# EAGLE design board (EAGLE 9.3.1)
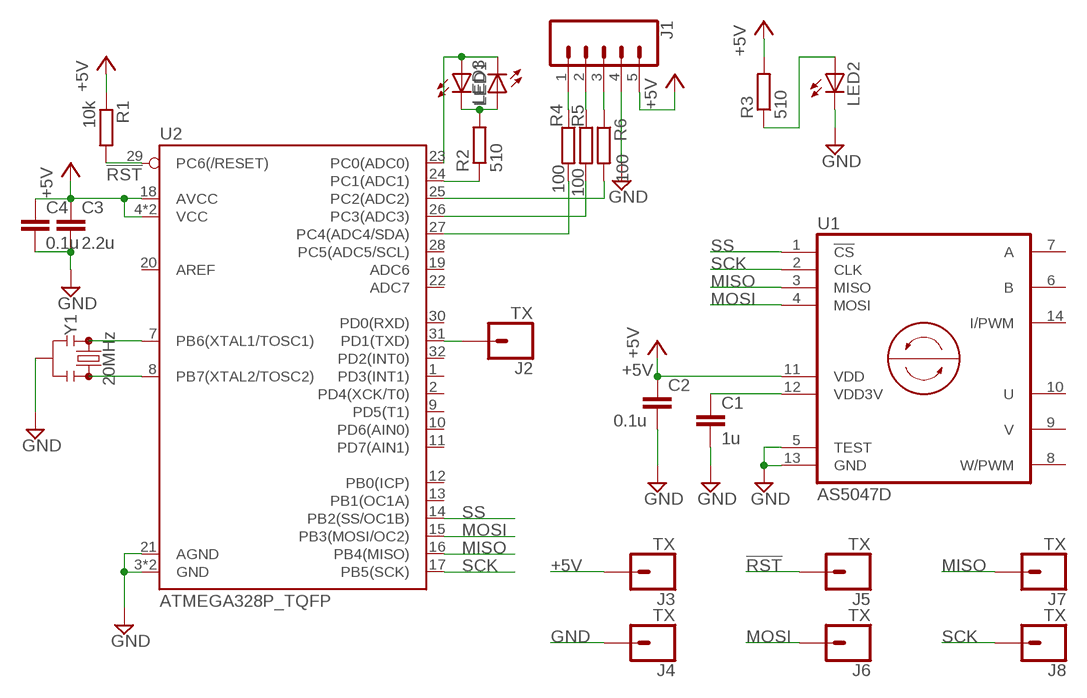
[diagram p0: schematic, sheet 1]

## Parts
C1  1u  C-EUC0603  [C0603]
C2  0.1u  C-EUC0603  [C0603]
C3  2.2u  C-EUC0603  [C0603]
C4  0.1u  C-EUC0603  [C0603]
J1  CONN_05PTH_LONGPADS  [1X05_LONGPADS]
J2  TX  CONN_01PTH_NO_SILK_YES_STOP  [1X01_NO_SILK]
J3  TX  CONN_01PTH_NO_SILK_YES_STOP  [1X01_NO_SILK]
J4  TX  CONN_01PTH_NO_SILK_YES_STOP  [1X01_NO_SILK]
J5  TX  CONN_01PTH_NO_SILK_YES_STOP  [1X01_NO_SILK]
J6  TX  CONN_01PTH_NO_SILK_YES_STOP  [1X01_NO_SILK]
J7  TX  CONN_01PTH_NO_SILK_YES_STOP  [1X01_NO_SILK]
J8  TX  CONN_01PTH_NO_SILK_YES_STOP  [1X01_NO_SILK]
LED1  LEDSML0805  [SML0805]
LED2  LEDSML0805  [SML0805]
LED3  LEDSML0805  [SML0805]
R1  10k  R-EU_R0603  [R0603]
R2  510  R-EU_R0603  [R0603]
R3  510  R-EU_R0603  [R0603]
R4  100  R-EU_R0603  [R0603]
R5  100  R-EU_R0603  [R0603]
R6  100  R-EU_R0603  [R0603]
U1  AS5047D  AS5047P  [TSSOP14]
U2  ATMEGA328P_TQFP  [TQFP32-08]
Y1  20MHz  CSTCE20M0V53-R0SMD_3.2X1.3  [CSTCE20M0V53-R0]

## Nets
!RST: J5.1 R1.2 U2.29(PC6(/RESET))
+5V: C2.1 C3.1 C4.1 J1.5 J3.1 R1.1 R3.2 U1.11(VDD) U2.4(VCC) U2.6(VCC) U2.18(AVCC)
GND: C1.2 C2.2 C3.2 C4.2 J1.4 J4.1 LED2.C U1.5(TEST) U1.13(GND) U2.3(GND) U2.5(GND) U2.21(AGND) Y1.2
MISO: J7.1 U1.3(MISO) U2.16(PB4(MISO))
MOSI: J6.1 U1.4(MOSI) U2.15(PB3(MOSI/OC2))
N$1: U2.7(PB6(XTAL1/TOSC1)) Y1.1
N$2: U2.8(PB7(XTAL2/TOSC2)) Y1.3
N$3: R6.2 U2.25(PC2(ADC2))
N$4: R4.2 U2.27(PC4(ADC4/SDA))
N$5: R5.2 U2.26(PC3(ADC3))
N$7: LED1.A LED3.C U2.23(PC0(ADC0))
N$8: J1.1 R4.1
N$9: LED2.A R3.1
N$10: J2.1 U2.31(PD1(TXD))
N$11: J1.2 R5.1
N$13: R2.1 U2.24(PC1(ADC1))
N$14: LED1.C LED3.A R2.2
N$15: J1.3 R6.1
SCK: J8.1 U1.2(CLK) U2.17(PB5(SCK))
SS: U1.1(!CS!) U2.14(PB2(SS/OC1B))
VDD3V: C1.1 U1.12(VDD3V)
Unconnected: U1.6(B) U1.7(A) U1.8(W/PWM) U1.9(V) U1.10(U) U1.14(I/PWM) U2.1(PD3(INT1)) U2.2(PD4(XCK/T0)) U2.9(PD5(T1)) U2.10(PD6(AIN0)) U2.11(PD7(AIN1)) U2.12(PB0(ICP)) U2.13(PB1(OC1A)) U2.19(ADC6) U2.20(AREF) U2.22(ADC7) U2.28(PC5(ADC5/SCL)) U2.30(PD0(RXD)) U2.32(PD2(INT0))

## Library data of the parts
C1-C4 = rcl:C-EU: CAPACITOR, European symbol; SPICEPREFIX: C
J1 = SparkFun-Connectors:CONN_05: Multi connection point. Often used as Generic Header-pin footprint for 0.1 inch spaced/style header connections On any of the 0.1 inch spaced packages, you can populate with these: Break Away Headers - Straight <https://www.sparkfun.com/products/116> (PRT-00116) Break Away Male Headers - Right Angle <https://www.sparkfun.com/products/553> (PRT-00553) Female Headers <https://www.sparkfun.com/products/115> (PRT-00115) Break Away Headers - Machine Pin <https://www.sparkfun.com/products/117> (PRT-00117) Break Away Female Headers - Swiss Machine Pin <https://www.sparkfun.com/products/743> (PRT-00743) For SCREWTERMINALS and SPRING TERMINALS visit here: Screw Terimnals on SparkFun.com <https://www.sparkfun.com/search/results?term=Screw+Terminals> (5mm/3.5mm/2.54mm spacing) This device is also useful as a general connection point to wire up your design to another part of your project. Our various solder wires solder well into these plated through hole pads. Hook-Up Wire - Assortment (Stranded, 22 AWG) <https://www.sparkfun.com/products/11375> (PRT-11375) Hook-Up Wire - Assortment (Solid Core, 22 AWG) <https://www.sparkfun.com/products/11367> (PRT-11367) View the entire wire category on our website here <https://www.sparkfun.com/categories/141> Special notes: Molex polarized connector foot print use with SKU : PRT-08231 with associated crimp pins and housings. 1MM SMD Version SKU: PRT-10208
J2-J8 = SparkFun-Connectors:CONN_01: Single connection point. Often used as Generic Header-pin footprint for 0.1 inch spaced/style header connections On any of the 0.1 inch spaced packages, you can populate with these: Break Away Headers - Straight <https://www.sparkfun.com/products/116> (PRT-00116) Break Away Male Headers - Right Angle <https://www.sparkfun.com/products/553> (PRT-00553) Female Headers <https://www.sparkfun.com/products/115> (PRT-00115) Break Away Headers - Machine Pin <https://www.sparkfun.com/products/117> (PRT-00117) Break Away Female Headers - Swiss Machine Pin <https://www.sparkfun.com/products/743> (PRT-00743) This device is also useful as a general connection point to wire up your design to another part of your project. Our various solder wires solder well into these plated through hole pads. Hook-Up Wire - Assortment (Stranded, 22 AWG) <https://www.sparkfun.com/products/11375> (PRT-11375) Hook-Up Wire - Assortment (Solid Core, 22 AWG) <https://www.sparkfun.com/products/11367> (PRT-11367) View the entire wire category on our website here <https://www.sparkfun.com/categories/141> Special notes: SMTSO-256-ET is a "flush mount" nut for a 4-40 screw. We mostly use this on specialty testbeds; it is a nice way to connect hardware to your PCB at an adjustable hieght. Also note, the SNAP packages are for using a snappable style connector. We sell a baggie of snaps and they are also used on two LilyPad designs: Snap Assortment - 30 pack (male and female) <https://www.sparkfun.com/products/11347> (DEV-11347) LilyPad Arduino SimpleSnap <https://www.sparkfun.com/products/10941> (DEV-10941) LilyPad SimpleSnap Protoboard <https://www.sparkfun.com/products/10940> (DEV-10940)
LED1-LED3 = led:LED: LED OSRAM: - CHIPLED LG R971, LG N971, LY N971, LG Q971, LY Q971, LO R971, LY R971 LH N974, LH R974 LS Q976, LO Q976, LY Q976 LO Q996 - Hyper CHIPLED LW Q18S LB Q993, LB Q99A, LB R99A - SideLED LS A670, LO A670, LY A670, LG A670, LP A670 LB A673, LV A673, LT A673, LW A673 LH A674 LY A675 LS A676, LA A676, LO A676, LY A676, LW A676 LS A679, LY A679, LG A679 - Hyper Micro SIDELED® LS Y876, LA Y876, LO Y876, LY Y876 LT Y87S - SmartLED LW L88C, LW L88S LB L89C, LB L89S, LG L890 LS L89K, LO L89K, LY L89K LS L896, LA L896, LO L896, LY L896 - TOPLED LS T670, LO T670, LY T670, LG T670, LP T670 LSG T670, LSP T670, LSY T670, LOP T670, LYG T670 LG T671, LOG T671, LSG T671 LB T673, LV T673, LT T673, LW T673 LH T674 LS T676, LA T676, LO T676, LY T676, LB T676, LH T676, LSB T676, LW T676 LB T67C, LV T67C, LT T67C, LS T67K, LO T67K, LY T67K, LW E67C LS E67B, LA E67B, LO E67B, LY E67B, LB E67C, LV E67C, LT E67C LW T67C LS T679, LY T679, LG T679 LS T770, LO T770, LY T770, LG T770, LP T770 LB T773, LV T773, LT T773, LW T773 LH T774 LS E675, LA E675, LY E675, LS T675 LS T776, LA T776, LO T776, LY T776, LB T776 LHGB T686 LT T68C, LB T68C - Hyper Mini TOPLED® LB M676 - Mini TOPLED Santana® LG M470 LS M47K, LO M47K, LY M47K Source: http://www.osram.convergy.de LUXEON: - LUMILED® LXK2-PW12-R00, LXK2-PW12-S00, LXK2-PW14-U00, LXK2-PW14-V00 LXK2-PM12-R00, LXK2-PM12-S00, LXK2-PM14-U00 LXK2-PE12-Q00, LXK2-PE12-R00, LXK2-PE12-S00, LXK2-PE14-T00, LXK2-PE14-U00 LXK2-PB12-K00, LXK2-PB12-L00, LXK2-PB12-M00, LXK2-PB14-N00, LXK2-PB14-P00, LXK2-PB14-Q00 LXK2-PR12-L00, LXK2-PR12-M00, LXK2-PR14-Q00, LXK2-PR14-R00 LXK2-PD12-Q00, LXK2-PD12-R00, LXK2-PD12-S00 LXK2-PH12-R00, LXK2-PH12-S00 LXK2-PL12-P00, LXK2-PL12-Q00, LXK2-PL12-R00 Source: www.luxeon.com KINGBRIGHT: KA-3528ASYC Source: www.kingbright.com
R1-R6 = rcl:R-EU_: RESISTOR, European symbol; SPICEPREFIX: R
U1 = ams:AS5047: ROTARY ENCODER 14-bit On-Axis Magnetic Rotary Position Sensor 12-Bit Decimal & Binary Incremental Pulse Count 28krpm high speed capability
U2 = SparkFun-IC-Microcontroller:ATMEGA328P_TQFP: Popular 328P in QFP Storefront component: ATmega328 - TQFP <https://www.sparkfun.com/products/13448> (COM-13448) Datasheet <http://www.sparkfun.com/datasheets/Components/SMD/ATMega328.pdf> SparkFun Products SparkFun RedBoard - Programmed with Arduino <https://www.sparkfun.com/products/12757> (DEV-12757) Arduino Pro Mini 328 - 5V/16MHz <https://www.sparkfun.com/products/11113> (DEV-11113) Arduino Pro Mini 328 - 3.3V/8MHz <https://www.sparkfun.com/products/11114> (DEV-11114) SparkFun OpenLog <https://www.sparkfun.com/products/13712> (DEV-13712) SparkFun MicroView - OLED Arduino Module <https://www.sparkfun.com/products/12923> (DEV-12923) SparkFun Digital Sandbox <https://www.sparkfun.com/products/12651> (DEV-12651) SparkFun PicoBoard <https://www.sparkfun.com/products/11888> (WIG-11888) Arduino Fio <https://www.sparkfun.com/products/10116> (DEV-10116) LilyPad Arduino 328 Main Board <https://www.sparkfun.com/products/13342> (DEV-13342) SparkFun RedStick <https://www.sparkfun.com/products/13741> (DEV-13741) LilyPad MP3 <https://www.sparkfun.com/products/11013> (DEV-11013) LilyPad Arduino SimpleSnap <https://www.sparkfun.com/products/10941> (DEV-10941) SparkFun Stepoko <https://www.sparkfun.com/products/13899> (ROB-13899) SparkFun Geiger Counter <https://www.sparkfun.com/products/11345> (SEN-11345) SparkFun EL Sequencer <https://www.sparkfun.com/products/12781> (COM-12781) Arduino Pro 328 - 5V/16MHz <https://www.sparkfun.com/products/10915> (DEV-10915) CryptoCape <https://www.sparkfun.com/products/12773> (DEV-12773) SparkFun IR Thermometer Evaluation Board - MLX90614 <https://www.sparkfun.com/products/10740> (SEN-10740) SparkFun RedBot Mainboard <https://www.sparkfun.com/products/12097> (ROB-12097) Arduino Pro 328 - 3.3V/8MHz <https://www.sparkfun.com/products/10914> (DEV-10914) SparkFun Block for Intel® Edison - Arduino <https://www.sparkfun.com/products/13036> (DEV-13036) SparkFun Simon Says - Surface Mount Soldering Kit <https://www.sparkfun.com/products/10935> (KIT-10935) SparkFun 7-Segment Serial Display - Red <https://www.sparkfun.com/products/11441> (COM-11441) SparkFun 7-Segment Serial Display - White <https://www.sparkfun.com/products/11629> (COM-11629) SparkFun 7-Segment Serial Display - Yellow <https://www.sparkfun.com/products/11443> (COM-11443) SparkFun 7-Segment Serial Display - Kelly Green <https://www.sparkfun.com/products/11440> (COM-11440) SparkFun 7-Segment Serial Display - Blue <https://www.sparkfun.com/products/11442> (COM-11442) SparkFun OpenSegment Serial Display - 20mm (Blue) <https://www.sparkfun.com/products/11647> (COM-11647) SparkFun OpenSegment Serial Display - 20mm (Green) <https://www.sparkfun.com/products/11646> (COM-11646) SparkFun OpenSegment Serial Display - 20mm (White) <https://www.sparkfun.com/products/11648> (COM-11648) SparkFun OpenSegment Serial Display - 20mm (Red) <https://www.sparkfun.com/products/11644> (COM-11644) SparkFun OpenSegment Serial Display - 20mm (Yellow) <https://www.sparkfun.com/products/11645> (COM-11645) SparkFun OpenSegment Shield <https://www.sparkfun.com/products/13190> (DEV-13190); PROD_ID: IC-09069
Y1 = AS5047D:CSTCE20M0V53-R0: 20MHz Resonator Digikey Example <http://www.digikey.com/product-detail/en/murata-electronics-north-america/CSTCE16M0V53-R0/490-1198-1-ND/584635> Frequency: 20MHz Frequency Stability: ±0.3% Frequency Tolerance: ±0.5% Capacitance: 15pF SparkFun Products SparkFun OpenLog <https://www.sparkfun.com/products/13712> SparkFun MicroView - OLED Arduino Module <https://www.sparkfun.com/products/12923>; PROD_ID: XTAL-08900; VALUE: 16MHz

## Net classes
0 default: width 0.008 mm, drill 0.013 mm, clearance 0.008 mm

## Board
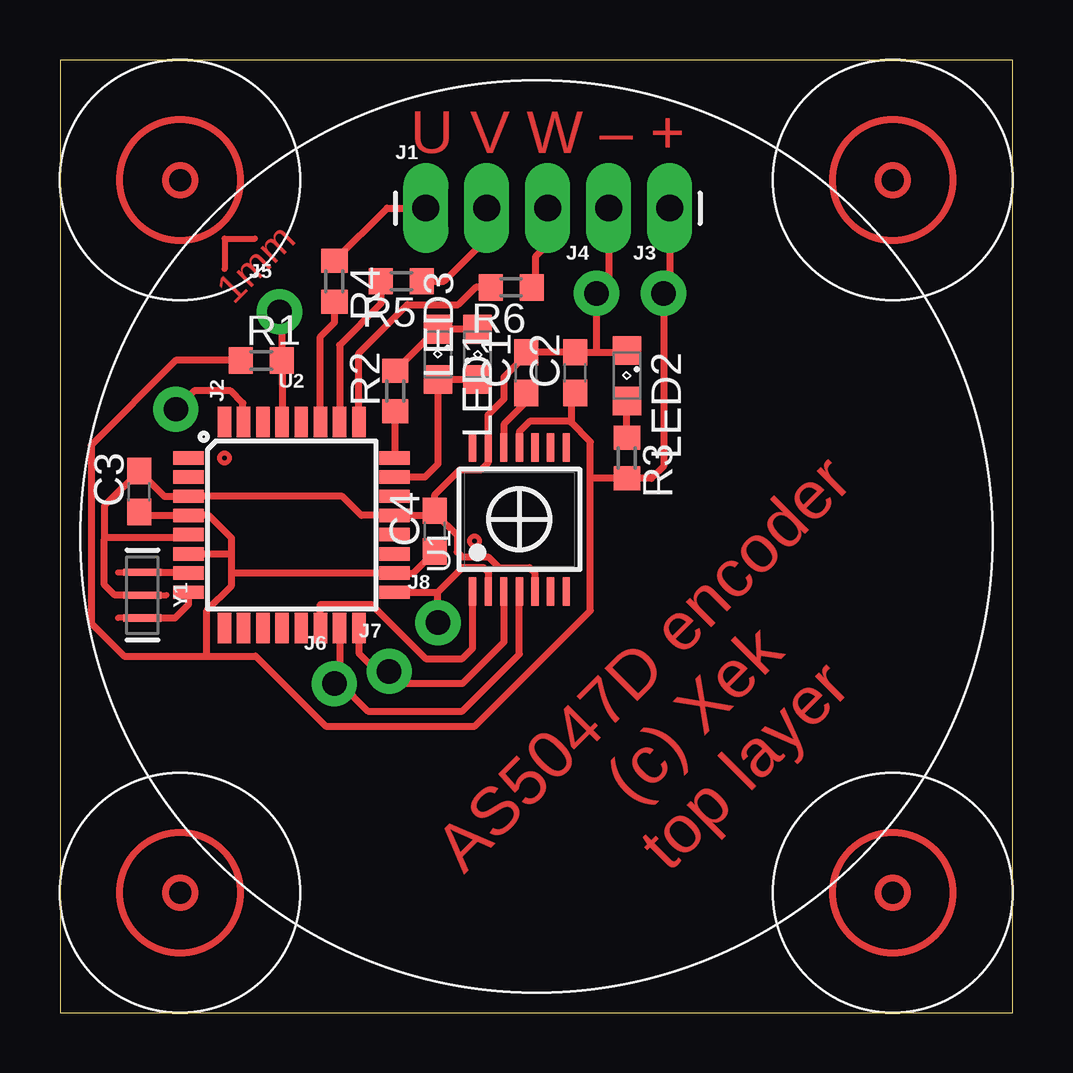
[diagram p1: board, top side]

Size 39.7 x 39.7 mm. Coordinates in mm from the lower left corner, seen from the top.
Outline: 0,0 39.7,0 39.7,39.7 0,39.7 0,0
Copper layers (1*16): Top 0.035mm / dielectric 1.5mm / Bottom 0.035mm
Design rules "default": minimum track width 6mil, minimum drill 0.35mm, track to track 6mil, track to pad 6mil, pad to pad 6mil, via to via 6mil, smd to smd 6mil, copper to edge 40mil, drill to drill 6mil, minimum pad ring 10mil, minimum via ring 8mil, stop-mask expansion 4mil, vias tented up to drill 0mil, thermal gap 10mil

### Footprints (pad centres in the part's own frame; a part is rotated, then mirrored left to right if it is on the bottom)
C0603 = smd 1.1 x 1: 1 -0.85,0; 2 0.85,0
1X05_LONGPADS = drill 1.118 pad 1.88 long: 1 0,0; 2 2.54,0; 3 5.08,0; 4 7.62,0; 5 10.16,0
1X01_NO_SILK = drill 1.016 pad 1.88: 1 0,0
SML0805 = smd 1.2 x 1.2: A 1.05,0; C -1.05,0
R0603 = smd 1 x 1.1: 1 -0.85,0; 2 0.85,0
TSSOP14 = smd 0.305 x 1.2: 1 -1.95,-3; 2 -1.3,-3; 3 -0.65,-3; 4 0,-3; 5 0.65,-3; 6 1.3,-3; 7 1.95,-3; 8 1.95,3; 9 1.3,3; 10 0.65,3; 11 0,3; 12 -0.65,3; 13 -1.3,3; 14 -1.95,3
TQFP32-08 = smd 1.27 x 0.559: 1 -4.293,2.8; 2 -4.293,2; 3 -4.293,1.2; 4 -4.293,0.4; 5 -4.293,-0.4; 6 -4.293,-1.2; 7 -4.293,-2; 8 -4.293,-2.8; 17 4.293,-2.8; 18 4.293,-2; 19 4.293,-1.2; 20 4.293,-0.4; 21 4.293,0.4; 22 4.293,1.2; 23 4.293,2; 24 4.293,2.8 | smd 0.559 x 1.27: 9 -2.8,-4.293; 10 -2,-4.293; 11 -1.2,-4.293; 12 -0.4,-4.293; 13 0.4,-4.293; 14 1.2,-4.293; 15 2,-4.293; 16 2.8,-4.293; 25 2.8,4.293; 26 2,4.293; 27 1.2,4.293; 28 0.4,4.293; 29 -0.4,4.293; 30 -1.2,4.293; 31 -2,4.293; 32 -2.8,4.293
CSTCE20M0V53-R0 = smd 0.3 x 1.6: 1 -0.95,0; 2 0,0; 3 0.95,0

### Placement (x,y rotation side)
C1  19.43,26.67 90 top
C2  21.46,26.67 90 top
C3  3.3,21.72 90 top
C4  15.62,20.07 90 top
J1  15.24,33.53 0 top
J2  4.83,25.15 270 top
J3  25.15,29.97 0 top
J4  22.35,29.97 0 top
J5  9.14,29.21 0 top
J6  11.43,13.72 0 top
J7  13.72,14.22 0 top
J8  15.75,16.26 0 top
LED1  15.75,27.43 270 top
LED2  23.62,26.54 270 top
LED3  17.4,27.43 90 top
R1  8.38,27.18 0 top
R2  13.97,25.91 90 top
R3  23.62,23.11 270 top
R4  11.43,30.48 270 top
R5  14.22,30.48 180 top
R6  18.8,30.23 180 top
U1  19.14,20.56 0 top
U2  9.65,20.32 0 top
Y1  3.43,17.4 270 top

### Tracks (layer width: path | path; a pad name or v marks a point on that pad's centre or on a via)
!RST
  Top 0.3: U2.29 9.25,27.16 R1.2 9.23,29.12 J5.1
+5V
  Top 0.3: U2.6 7.15,19.12 | 7.15,19.12 7.15,19.77 6.2,20.72 U2.4 3.45,20.72 C3.1 | 7.15,18.32 U2.18 14.72,18.32 C4.1 | R1.1 4.83,27.18 1.29,23.64 1.29,16.23 2.67,14.86 6.12,14.86 | 6.12,14.86 8.15,14.86 11.07,11.94 17.28,11.94 22.1,16.75 22.1,22.35 | 7.15,18.32 7.15,17.79 6.12,16.76 6.12,14.86 | 7.15,18.32 7.15,19.12 | J1.5 25.4,30.23 J3.1 25.15,22.77 24.64,22.26 R3.2 22.19,22.26 22.1,22.35 | U1.11 19.14,24.21 19.57,24.64 21.25,24.64 21.29,24.59 | 22.1,22.35 22.1,23.79 21.29,24.59 | C2.1 21.29,25.65 21.29,24.59
GND
  Top 0.3: Y1.2 2.29,17.4 1.85,17.83 1.85,19.74 | 1.85,19.74 1.91,19.79 5.23,19.79 U2.5 | 1.85,19.74 1.85,21.12 C3.2 4.35,21.52 U2.3 11.75,21.52 12.55,20.72 U2.21 15.43,20.72 C4.2 | U1.5 19.79,18.31 19.56,18.54 18.29,18.54 17.84,18.99 16.76,18.99 16.55,19.21 16.55,19.89 15.62,20.82 C4.2 | J1.4 22.86,30.48 J4.1 22.35,27.52 | C4.2 15.62,21.59 16.64,22.61 17.53,22.61 17.84,22.92 U1.13 17.84,24.91 18.5,25.57 18.5,26.5 19.43,27.43 C1.2 C2.2 22.35,27.52 | 22.35,27.52 23.55,27.52 LED2.C
MISO
  Top 0.3: U1.3 18.49,15.44 16.76,13.72 14.22,13.72 J7.1 13.21,14.22 12.45,14.98 U2.16
MOSI
  Top 0.3: U1.4 19.14,14.95 16.77,12.57 12.83,12.57 11.65,13.75 | U2.15 11.65,13.94 11.65,13.75 | J6.1 11.65,13.72 11.65,13.75
N$1
  Top 0.3: Y1.1 5.02,18.35 5.08,18.29 5.33,18.29 U2.7
N$2
  Top 0.3: Y1.3 4.8,16.45 5.36,17.01 U2.8
N$3
  Top 0.3: U2.25 12.45,27.48 14.47,29.5 16.59,29.5 17.31,30.23 R6.2
N$4
  Top 0.3: U2.27 10.85,28.18 11.43,28.75 R4.2
N$5
  Top 0.3: U2.26 11.65,27.82 13.37,29.54 R5.2
N$7
  Top 0.3: LED3.C LED1.A 15.75,22.86 15.21,22.32 U2.23
N$8
  Top 0.3: R4.1 13.63,33.53 J1.1
N$9
  Top 0.3: R3.1 LED2.A
N$10
  Top 0.3: U2.31 7.62,24.64 7.62,25.4 7.11,25.91 5.59,25.91 J2.1
N$11
  Top 0.3: R5.1 16,30.48 17.78,32.26 J1.2
N$12
  Top 0.25: 6.86,30.99 6.86,32.26 8.13,32.26
N$13
  Top 0.3: R2.1 13.95,25.03 U2.24
N$14
  Top 0.3: LED3.A LED1.C 15.69,28.48 R2.2
N$15
  Top 0.3: J1.3 20.32,32 19.81,31.5 19.81,30.39 R6.1
SCK
  Top 0.3: U1.2 17.84,18.35 17.65,18.54 16.76,18.54 15.75,17.53 | U2.17 15.74,17.52 15.75,17.53 | J8.1 15.75,17.53
SS
  Top 0.3: U2.14 10.85,17.02 12.97,17.02 15.23,14.76 16.77,14.76 17.19,15.18 U1.1
VDD3V
  Top 0.3: U1.12 18.49,24.51 19.43,25.45 C1.1
(copper drawn outside any net)
  shapes: Top circle x10

### Text on the board
Top: U V W – + | 1mm | AS5047D encoder / (c) Xek / top layer